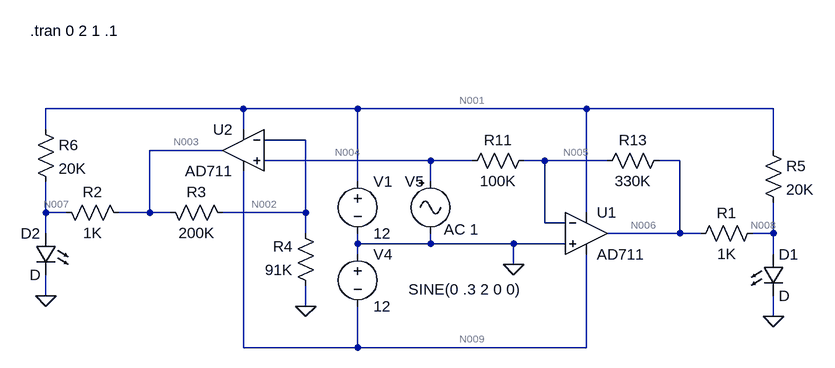
[diagram p0: schematic sigmon.asc]
sigmon.asc, the LTspice schematic file:
Version 4
SHEET 1 1412 736
WIRE -192 176 -496 176
WIRE -16 176 -192 176
WIRE 336 176 -16 176
WIRE 624 176 336 176
WIRE -496 208 -496 176
WIRE -192 208 -192 176
WIRE -96 224 -160 224
WIRE -224 240 -336 240
WIRE 624 240 624 176
WIRE 96 256 -160 256
WIRE 160 256 96 256
WIRE 272 256 240 256
WIRE 368 256 272 256
WIRE 480 256 448 256
WIRE -16 288 -16 176
WIRE 96 288 96 256
WIRE -496 336 -496 288
WIRE -464 336 -496 336
WIRE -336 336 -336 240
WIRE -336 336 -384 336
WIRE -304 336 -336 336
WIRE -96 336 -96 224
WIRE -96 336 -224 336
WIRE 336 336 336 176
WIRE 272 352 272 256
WIRE 304 352 272 352
WIRE -496 368 -496 336
WIRE -96 368 -96 336
WIRE 480 368 480 256
WIRE 480 368 368 368
WIRE 512 368 480 368
WIRE 624 368 624 320
WIRE 624 368 592 368
WIRE -16 384 -16 368
WIRE 96 384 96 368
WIRE 96 384 -16 384
WIRE 224 384 96 384
WIRE 304 384 224 384
WIRE -16 400 -16 384
WIRE 624 400 624 368
WIRE 224 416 224 384
WIRE -496 464 -496 432
WIRE -96 480 -96 448
WIRE 624 496 624 464
WIRE -192 544 -192 272
WIRE -16 544 -16 480
WIRE -16 544 -192 544
WIRE 336 544 336 400
WIRE 336 544 -16 544
FLAG 224 416 0
FLAG 624 496 0
FLAG -496 464 0
FLAG -96 480 0
SYMBOL voltage -16 272 R0
WINDOW 123 0 0 Left 0
WINDOW 39 0 0 Left 0
SYMATTR InstName V1
SYMATTR Value 12
SYMBOL voltage -16 384 R0
WINDOW 123 0 0 Left 0
WINDOW 39 0 0 Left 0
SYMATTR InstName V4
SYMATTR Value 12
SYMBOL res 256 240 R90
WINDOW 0 0 56 VBottom 2
WINDOW 3 32 56 VTop 2
SYMATTR InstName R11
SYMATTR Value 100K
SYMBOL res 464 240 R90
WINDOW 0 0 56 VBottom 2
WINDOW 3 32 56 VTop 2
SYMATTR InstName R13
SYMATTR Value 330K
SYMBOL Misc\\signal 96 272 R0
WINDOW 123 21 90 Left 2
WINDOW 39 0 0 Left 0
WINDOW 3 -34 182 Left 2
WINDOW 0 -39 16 Left 2
SYMATTR Value2 AC 1
SYMATTR Value SINE(0 .3 2 0 0)
SYMATTR InstName V5
SYMBOL Opamps\\AD711 336 304 R0
SYMATTR InstName U1
SYMBOL LED 608 400 R0
SYMATTR InstName D1
SYMBOL res 496 384 R270
WINDOW 0 32 56 VTop 2
WINDOW 3 0 56 VBottom 2
SYMATTR InstName R1
SYMATTR Value 1K
SYMBOL LED -480 368 M0
SYMATTR InstName D2
SYMBOL res -368 352 M270
WINDOW 0 32 56 VTop 2
WINDOW 3 0 56 VBottom 2
SYMATTR InstName R2
SYMATTR Value 1K
SYMBOL res -320 320 M90
WINDOW 0 0 56 VBottom 2
WINDOW 3 32 56 VTop 2
SYMATTR InstName R3
SYMATTR Value 200K
SYMBOL Opamps\\AD711 -192 176 M0
SYMATTR InstName U2
SYMBOL res -80 464 R180
WINDOW 0 36 76 Left 2
WINDOW 3 36 40 Left 2
SYMATTR InstName R4
SYMATTR Value 91K
SYMBOL res 608 224 R0
SYMATTR InstName R5
SYMATTR Value 20K
SYMBOL res -512 192 R0
SYMATTR InstName R6
SYMATTR Value 20K
TEXT -520 56 Left 2 !.tran 0 2 1 .1

The netlist it stands for:
* sigmon.asc
V1 N001 0 12
V4 0 N009 12
R11 N005 N004 100K
R13 N006 N005 330K
V5 N004 0 SINE(0 .3 2 0 0) AC 1
XU1 0 N005 N001 N009 N006 AD712  ; AD711, pins In+ In- V+ V- OUT
D1 N008 0 D
R1 N006 N008 1K
D2 N007 0 D
R2 N003 N007 1K
R3 N003 N002 200K
XU2 N004 N002 N001 N009 N003 AD712  ; AD711, pins In+ In- V+ V- OUT
R4 0 N002 91K
R5 N001 N008 20K
R6 N001 N007 20K
.model D D
.lib standard.dio
.tran 0 2 1 .1
.lib ADI1.lib
.backanno
.end

* Results of the author's LTspice run, read from the files saved beside the schematic
* Operating Point, zero values left out:
*   V(n001) = 12 V
*   V(n009) = -12 V
*   V(n005) = 389.8 nV
*   V(n006) = 9.926 µV
*   V(n008) = 553 mV
*   V(n007) = 553 mV
*   V(n003) = 6.247 µV
*   V(n002) = 389.8 nV
*   I(D2) = 19.32 µA
*   I(D1) = 19.32 µA
*   I(R6) = 572.3 µA
*   I(R5) = 572.3 µA
*   I(R4) = -4.284 pA
*   I(R3) = 29.28 pA
*   I(R2) = -553 µA
*   I(R1) = -553 µA
*   I(R13) = 28.9 pA
*   I(R11) = 3.898 pA
*   I(V5) = -21.1 pA
*   I(V4) = -10.43 mA
*   I(V1) = -10.47 mA
*   Ix(u1:1) = 25 pA
*   Ix(u1:2) = 25 pA
*   Ix(u1:3) = 4.661 mA
*   Ix(u1:4) = -5.214 mA
*   Ix(u1:5) = 553 µA
*   Ix(u2:1) = 25 pA
*   Ix(u2:2) = 25 pA
*   Ix(u2:3) = 4.661 mA
*   Ix(u2:4) = -5.214 mA
*   Ix(u2:5) = 553 µA
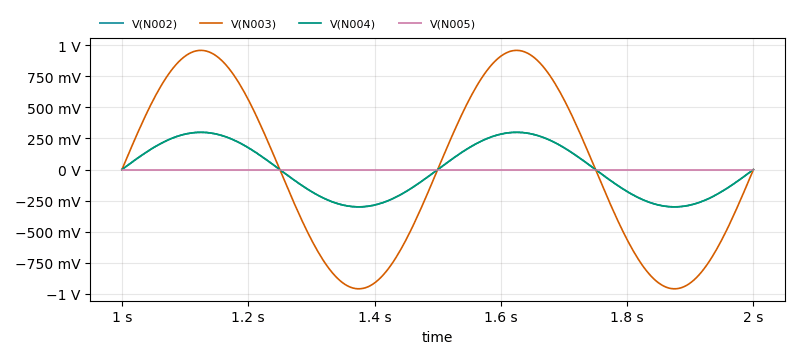
[diagram p1: Transient Analysis of sigmon.asc, plotted from the saved traces]
* Transient Analysis, 1 run:
*   V(N002): min -299.8 mV, max 299.8 mV, average 178.1 nV, rms 212 mV, last -57.53 nV
*   V(N003): min -958.6 mV, max 958.7 mV, average 5.568 µV, rms 678 mV, last 6.881 µV
*   V(N004): min -300 mV, max 300 mV, average 0 V, rms 212.1 mV, last 0 V
*   V(N005): min -1.995 µV, max 2.166 µV, average 210.7 nV, rms 1.486 µV, last 814.4 nV